# Altium schematic sheet OSSI-1 OBC_3.SchDoc: TITLE:
size 410 x 286 mm; Date: Date:; >LAST_DATE_TIME: 01/11/2015 13:38:47; Sheet:: Sheet:; >SHEET: 4; REV:: REV:; Document Number:: Document Number:; >DRAWING_NAME: OSSI-1 OBC.sch
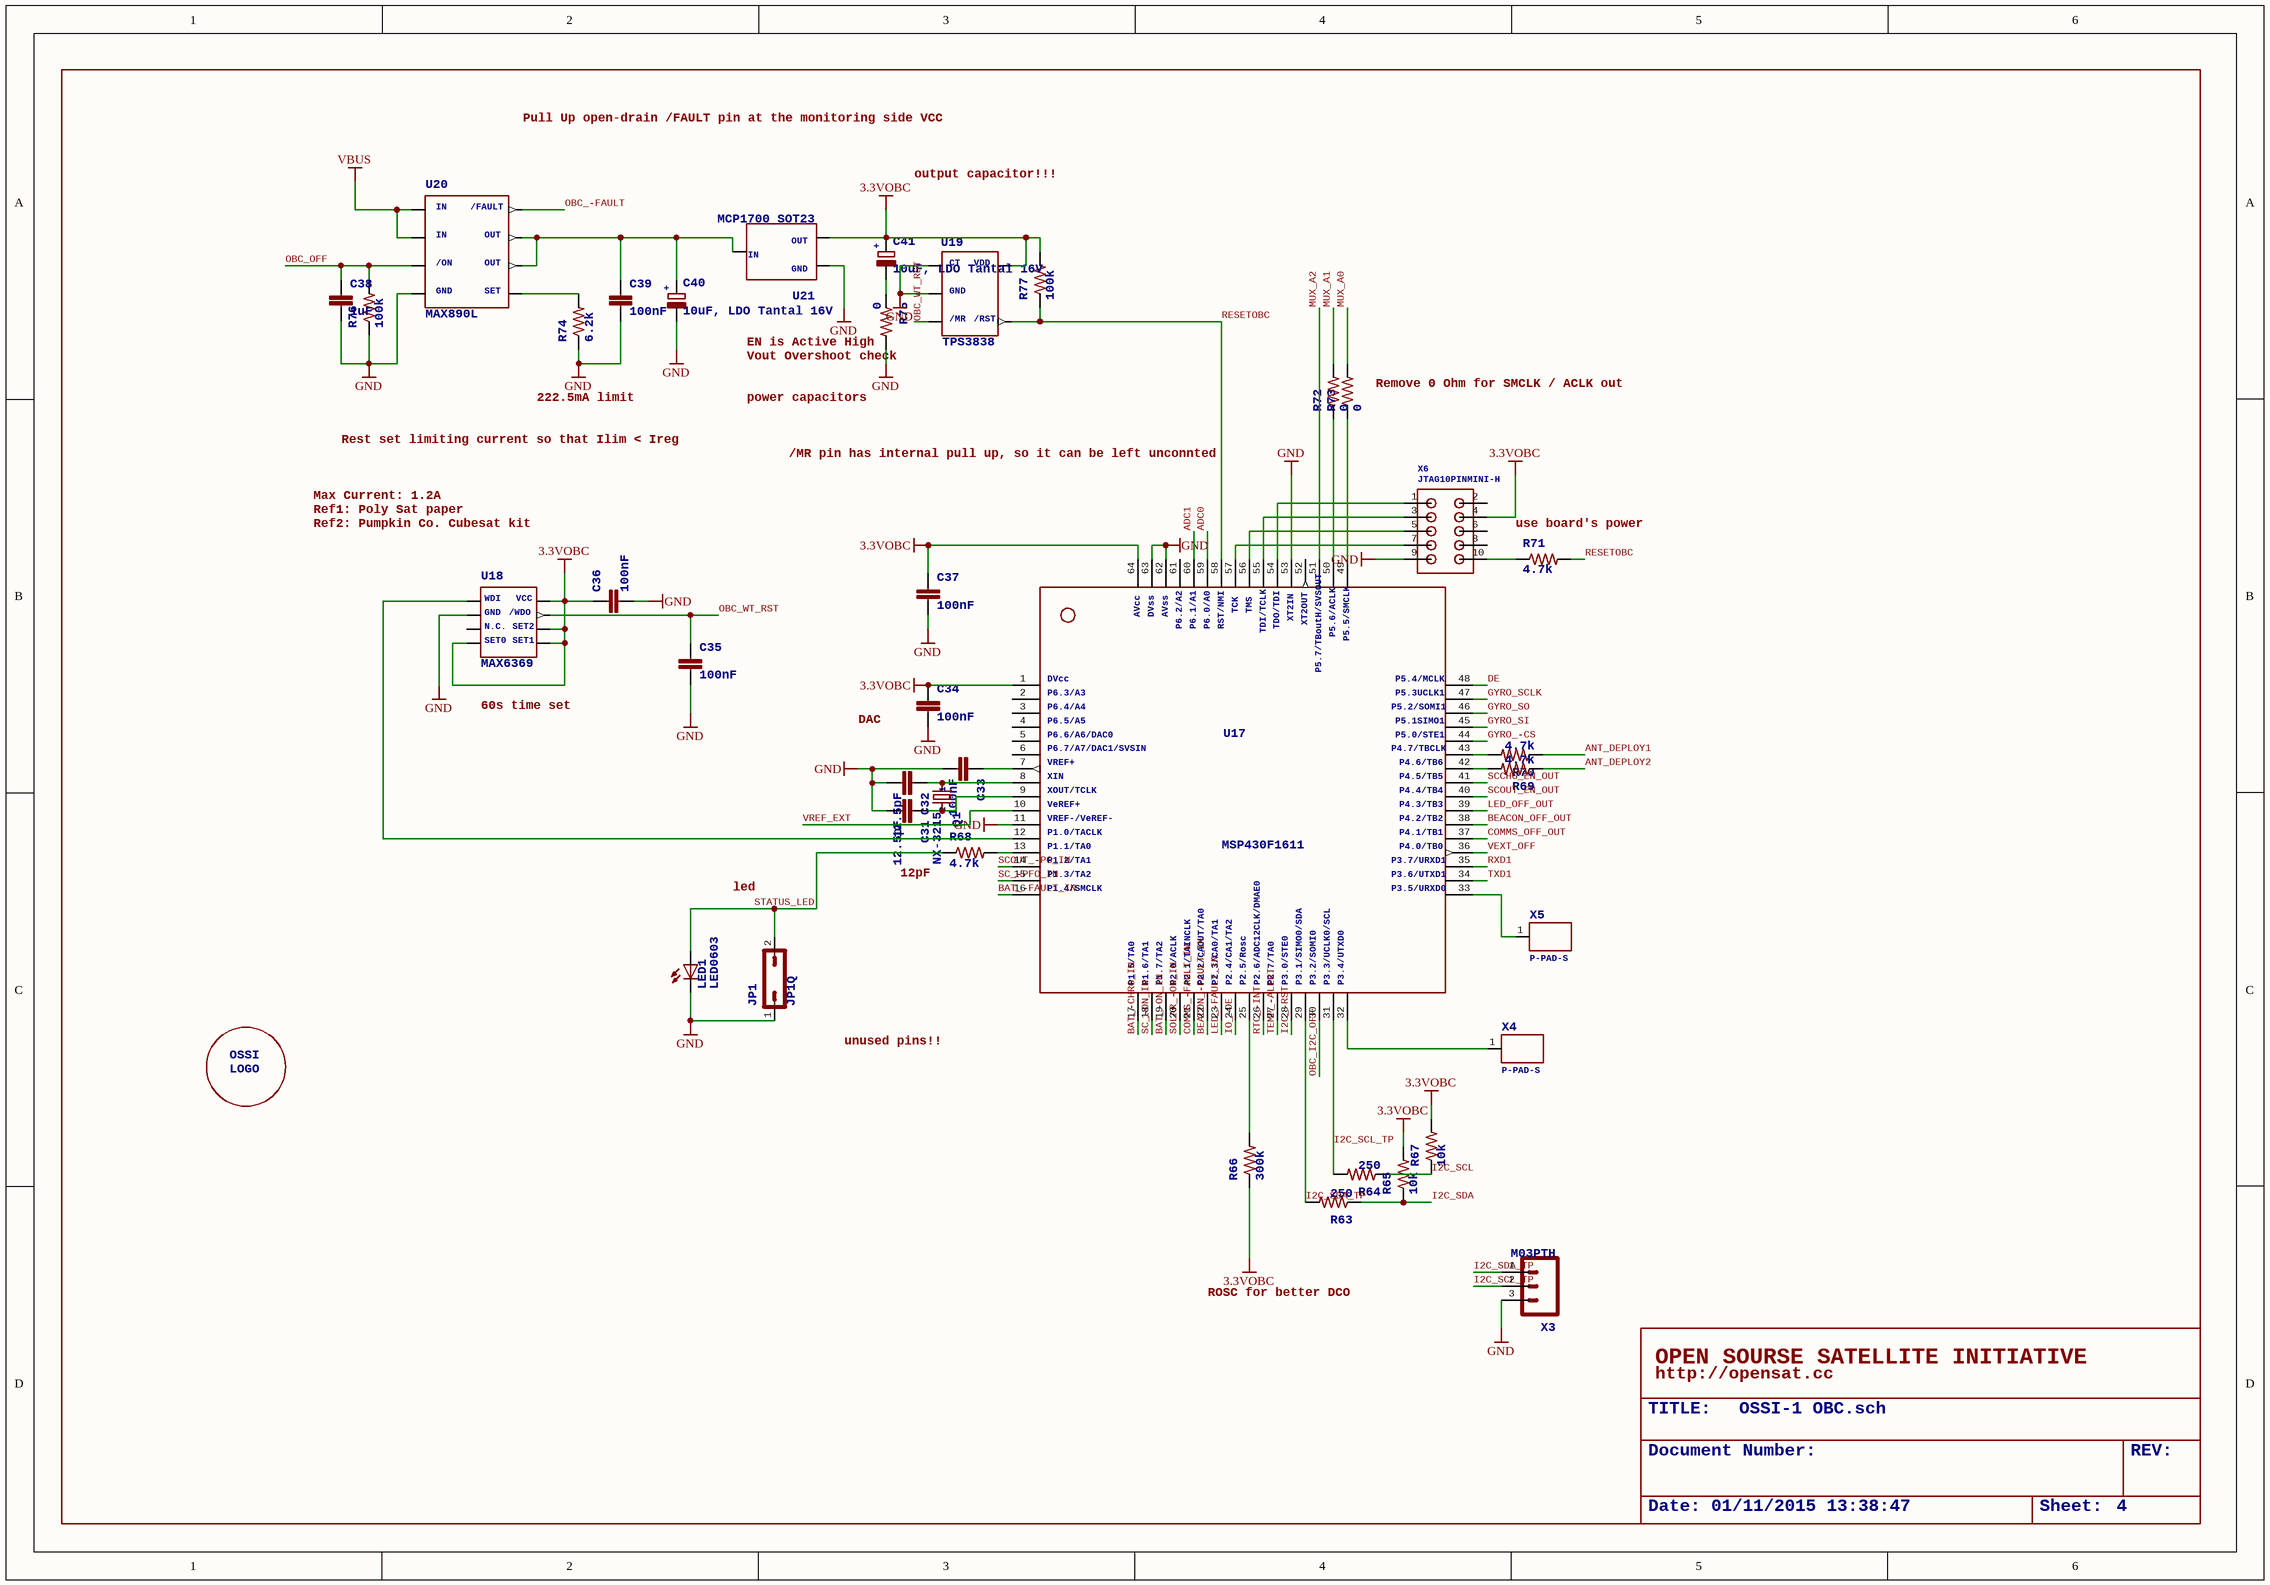
[diagram p0: OSSI-1 OBC_3.SchDoc]

## Parts
C31  >NAME: C31  [C0603(1608)]  (hidden comment: 12.5pF)
C32  >NAME: C32  [C0603(1608)]  (hidden comment: 12.5pF)
C33  >NAME: C33  [C0603(1608)]  (hidden comment: 100nF)
C34  >NAME: C34  [C0603(1608)]  (hidden comment: 100nF)
C35  >NAME: C35  [C0603(1608)]  (hidden comment: 100nF)
C36  >NAME: C36  [C0603(1608)]  (hidden comment: 100nF)
C37  >NAME: C37  [C0603(1608)]  (hidden comment: 100nF)
C38  >NAME: C38  [C0603(1608)]  (hidden comment: 1uF)
C39  >NAME: C39  [C0603(1608)]  (hidden comment: 100nF)
C40  >NAME: C40  [C1206(3216)-A]  (hidden comment: 10uF, LDO Tantal 16V)
C41  >NAME: C41  [C1206(3216)-A]  (hidden comment: 10uF, LDO Tantal 16V)
JP1  JP1Q  [JP1]
LED1  >NAME: LED1  [LED-0603]  (hidden comment: LED0603)
Q1  >NAME: Q1  [NX-3215]  (hidden comment: NX-3215)
R63  >NAME: R63  [R0603(1608)]  (hidden comment: 250)
R64  >NAME: R64  [R0603(1608)]  (hidden comment: 250)
R65  >NAME: R65  [R0603(1608)]  (hidden comment: 10k)
R66  >NAME: R66  [R0603(1608)]  (hidden comment: 300k)
R67  >NAME: R67  [R0603(1608)]  (hidden comment: 10k)
R68  >NAME: R68  [R0603(1608)]  (hidden comment: 4.7k)
R69  >NAME: R69  [R0603(1608)]  (hidden comment: 4.7k)
R70  >NAME: R70  [R0603(1608)]  (hidden comment: 4.7k)
R71  >NAME: R71  [R0603(1608)]  (hidden comment: 4.7k)
R72  >NAME: R72  [R0603(1608)]  (hidden comment: 0)
R73  >NAME: R73  [R0603(1608)]  (hidden comment: 0)
R74  >NAME: R74  [R0603(1608)]  (hidden comment: 6.2k)
R75  >NAME: R75  [R0603(1608)]  (hidden comment: 0)
R76  >NAME: R76  [R0603(1608)]  (hidden comment: 100k)
R77  >NAME: R77  [R0603(1608)]  (hidden comment: 100k)
U17  >NAME: U17  [PM/PAG64]  (hidden comment: MSP430F1611)
U18  >NAME: U18  [SOT23-8]  (hidden comment: MAX6369)
U19  >NAME: U19  [SOT23-5DBV]  (hidden comment: TPS3838)
U20  >NAME: U20  [SO8]  (hidden comment: MAX890L)
U21  >NAME: U21  [SOT23]  (hidden comment: MCP1700_SOT23)
U$1  OSSILOGORECT  [OSSILOGORECT1005]  (value not drawn)
X3  >NAME: X3  [1X03]  (hidden comment: M03PTH)
X4  >NAME: X4  [P-PAD-S]  (hidden comment: P-PAD-S)
X5  >NAME: X5  [P-PAD-S]  (hidden comment: P-PAD-S)
X6  >NAME: X6  [M50-3200545]  (hidden comment: JTAG10PINMINI-H)

## Nets
3.3VOBC: C34.1 C36.1 C37.1 C41.1(+) R65.2 R66.1 R67.2 R77.2 U17.1 U17.64 U18.4(P$4) U18.5(P$5) U18.6(P$6) U18.8(P$8) U19.5(P$5) U21.2 X6.4
GND: C31.2 C32.2 C33.2 C34.2 C35.2 C36.2 C37.2 C38.2 C39.2 C40.2(-) JP1.1 LED1.C R74.1 R75.2 R76.1 U17.11 U17.53 U17.62 U17.63 U18.2(P$2) U19.1(P$1) U19.2(P$2) U20.4(P$4) U21.1 X3.3 X6.9
VBUS: U20.1(P$1) U20.2(P$2)
ADC0: U17.59
ADC1: U17.60
ANT_DEPLOY1: R70.1
ANT_DEPLOY2: R69.1
BAT_-CHRG_IN: U17.17
BAT_-FAULT_IN: U17.16
BAT_-ON_IN: U17.19
BEACON_-FAULT_IN: U17.22
BEACON_OFF_OUT: U17.38
COMMS_-FAULT_IN: U17.21
COMMS_OFF_OUT: U17.37
DE: U17.48
GYRO_-CS: U17.44
GYRO_SCLK: U17.47
GYRO_SI: U17.45
GYRO_SO: U17.46
I2C_-RST: U17.28
I2C_SCL: R64.1 R67.1
I2C_SCL_TP: R64.2 U17.31 X3.2
I2C_SDA: R63.1 R65.1
I2C_SDA_TP: R63.2 U17.29 X3.1
IO_-OE: U17.24
LED_-FAULT_IN: U17.23
LED_OFF_OUT: U17.39
MUX_A0: R73.2
MUX_A1: R72.2
MUX_A2: U17.51
OBC_-FAULT: U20.8(P$8)
OBC_I2C_OFF: U17.30
OBC_OFF: C38.1 R76.2 U20.3(P$3)
OBC_WT_RST: C35.1 U18.7(P$7) U19.3(P$3)
RESETOBC: R71.2 R77.1 U17.58 U19.4(P$4)
RTC_-INT: U17.26
RXD1: U17.35
SC_-ON_IN: U17.18
SC_-PFO_IN: U17.15
SCCHG_EN_OUT: U17.41
SCOUT_-PG_IN: U17.14
SCOUT_EN_OUT: U17.40
SOLAR_-ON_IN: U17.20
STATUS_LED: JP1.2 LED1.A R68.1
TEMP_-ALERT: U17.27
TXD1: U17.34
VEXT_OFF: U17.36
VREF_EXT: U17.10
NetC31_1: C31.1 Q1.2 U17.9
NetC32_1: C32.1 Q1.1 U17.8
NetC33_1: C33.1 U17.7
NetC39_1: C39.1 C40.1(+) U20.6(P$6) U20.7(P$7) U21.3
NetC41_2: C41.2(-) R75.1
NetR66_2: R66.2 U17.25
NetR68_2: R68.2 U17.13
NetR69_2: R69.2 U17.42
NetR70_2: R70.2 U17.43
NetR71_1: R71.1 X6.10
NetR72_1: R72.1 U17.50
NetR73_1: R73.1 U17.49
NetR74_2: R74.2 U20.5(P$5)
NetU17_12: U17.12 U18.1(P$1)
NetU17_32: U17.32 X4.1(P$1)
NetU17_33: U17.33 X5.1(P$1)
NetU17_54: U17.54 X6.1
NetU17_55: U17.55 X6.3
NetU17_56: U17.56 X6.5
NetU17_57: U17.57 X6.7

Not connected (* = marked no-connect by the designer): U17 2 3 4 5 6 52 61; U18 3(P$3); X6 2 6 8

## Notes on the sheet
- Pull Up open-drain /FAULT pin at the monitoring side VCC
- output capacitor!!!
- (near R75) EN is Active High
- 222.5mA limit
- (near R75) Vout Overshoot check
- power capacitors
- Remove 0 Ohm for SMCLK / ACLK out
- Rest set limiting current so that Ilim < Ireg
- /MR pin has internal pull up, so it can be left unconnted
- Max Current: 1.2A
- Ref1: Poly Sat paper
- Ref2: Pumpkin Co. Cubesat kit
- (near R71) use board's power
- 60s time set
- DAC
- led
- (near R68) 12pF
- unused pins!!
- ROSC for better DCO
- OPEN SOURSE SATELLITE INITIATIVE
- http://opensat.cc

## Library data of the parts
C31-C39 = C0603(1608)
  C31 C32: >VALUE: 12.5pF
  C33-C37 C39: >VALUE: 100nF
  C38: >VALUE: 1uF
C40 C41 = C-TANTAL-A: <b>TAJA105M020RNJ</b> / <ul> / <li>Tantal Capacitor / </li> / <li>Manufacturer: AVX / </li> / <li>1206(3126) / </li> / <li>Ref: www.avx.com/docs/techinfo/tantappl.pdf</li> / </ul>; +: +; >VALUE: 10uF, LDO Tantal 16V
JP1 = JP1Q: <b>JUMPER</b>; >NAME: JP1; >VALUE: JP1Q
LED1 = LED0603: <b>LEDs</b> / Standard schematic elements and footprints for 5mm, 3mm, 1206, and 0603 sized LEDs. 5mm - Spark Fun Electronics SKU : COM-00529 (and others); >VALUE: LED0603
Q1 = NX-3215: NDK 32.768 kHz SMD Crystal<br /> / P/N: NX3215SA-32.768K-STD-MUA-9<br /> / <br /> / <b>Nominal frequency (kHz):</b> 32.768 <br/> / <b>Package Size (L×W×H : mm):</b>  3.2×1.5×0.8 <br/> / <b>Operating Temperature Range(*1)  /  Storage Temperature Range   (°C):</b>  -40 to +85  /  -40 to +85<br/> / <b>Level of drive:</b>   0.1µW (Max. 0.5µW) <br/> / <b>Frequency Tolerance (25±3°C):</b>  ±20×10-6 <br/> / <b>Load Capacitance:</b>  9.0pF, 12.5pF <br/> / <b>Equivalent Series Resistance:</b>  70kΩ Max.<br/> / <b>Ordering Code:</b>  NX3215SA-32.768K-STD-MUA-9 (Load Capacitance9.0pF) /NX3215SA-32.768K-STD-MUA-8 (Load Capacitance12.5pF); >VALUE: NX-3215; 1: 1; 2: 2
R63-R77 = R0603(1608)
  R63 R64: >VALUE: 250
  R65 R67: >VALUE: 10k
  R66: >VALUE: 300k
  R68-R71: >VALUE: 4.7k
  R72 R73 R75: >VALUE: 0
  R74: >VALUE: 6.2k
  R76 R77: >VALUE: 100k
U17 = MSP430F1611: <b>MSP430F1611</b>; AVcc: AVcc; DVss: DVss; AVss: AVss; P6.2/A2: P6.2/A2; P6.1/A1: P6.1/A1; P6.0/A0: P6.0/A0; RST/NMI: RST/NMI; TCK: TCK; TMS: TMS; TDI/TCLK: TDI/TCLK; TDO/TDI: TDO/TDI; XT2IN: XT2IN; XT2OUT: XT2OUT; P5.7/TBoutH/SVSOUT: P5.7/TBoutH/SVSOUT; P5.6/ACLK: P5.6/ACLK; P5.5/SMCLK: P5.5/SMCLK; DVcc: DVcc; P6.3/A3: P6.3/A3; P6.4/A4: P6.4/A4; P6.5/A5: P6.5/A5; P6.6/A6/DAC0: P6.6/A6/DAC0; P6.7/A7/DAC1/SVSIN: P6.7/A7/DAC1/SVSIN; VREF+: VREF+; XIN: XIN; XOUT/TCLK: XOUT/TCLK; VeREF+: VeREF+; VREF-/VeREF-: VREF-/VeREF-; P1.0/TACLK: P1.0/TACLK; P1.1/TA0: P1.1/TA0; P1.2/TA1: P1.2/TA1; P1.3/TA2: P1.3/TA2; P1.4/SMCLK: P1.4/SMCLK; P1.5/TA0: P1.5/TA0; P1.6/TA1: P1.6/TA1; P1.7/TA2: P1.7/TA2; P2.0/ACLK: P2.0/ACLK; P2.1/TAINCLK: P2.1/TAINCLK; P2.2/CAOUT/TA0: P2.2/CAOUT/TA0; P2.3/CA0/TA1: P2.3/CA0/TA1; P2.4/CA1/TA2: P2.4/CA1/TA2; P2.5/Rosc: P2.5/Rosc; P2.6/ADC12CLK/DMAE0: P2.6/ADC12CLK/DMAE0; P2.7/TA0: P2.7/TA0; P3.0/STE0: P3.0/STE0; P3.1/SIMO0/SDA: P3.1/SIMO0/SDA; P3.2/SOMI0: P3.2/SOMI0; P3.3/UCLK0/SCL: P3.3/UCLK0/SCL; P3.4/UTXD0: P3.4/UTXD0; P5.4/MCLK: P5.4/MCLK; P5.3UCLK1: P5.3UCLK1; P5.2/SOMI1: P5.2/SOMI1; P5.1SIMO1: P5.1SIMO1; P5.0/STE1: P5.0/STE1; P4.7/TBCLK: P4.7/TBCLK; P4.6/TB6: P4.6/TB6; P4.5/TB5: P4.5/TB5; P4.4/TB4: P4.4/TB4; P4.3/TB3: P4.3/TB3; P4.2/TB2: P4.2/TB2; P4.1/TB1: P4.1/TB1; P4.0/TB0: P4.0/TB0; P3.7/URXD1: P3.7/URXD1; P3.6/UTXD1: P3.6/UTXD1; P3.5/URXD0: P3.5/URXD0; >VALUE: MSP430F1611
U18 = MAX6369: <B>MAX6369</B> / <ul> / <li>Pin-Selectable Watchdog Timers</li> / <li>Max 6369 is Open-drain output</li> / <li>1 ms to 60 s seletable timeout</li> / </ul>; WDI: WDI; GND: GND; N.C.: N.C.; SET0: SET0; SET1: SET1; SET2: SET2; /WDO: /WDO; VCC: VCC; >VALUE: MAX6369
U19 = TPS3838: <b>TPS3838</b> / <br /> / NanoPower Supervisory IC from texas instruments.<br /> / TPS3838 is open-drain output; >VALUE: TPS3838; CT: CT; /MR: /MR; GND: GND; VDD: VDD; /RST: /RST
U20 = MAX890L: <B>MAX 890L</B> / <BR /> / 1.2A, Current-Limited, High-Side / P-Channel Switch with Thermal Shutdown BY MAXIM; IN: IN; /ON: /ON; GND: GND; SET: SET; OUT: OUT; /FAULT: /FAULT; >VALUE: MAX890L
U21 = MCP1700_SOT23: MCP1700 LDO from Microchips; >VALUE: MCP1700_SOT23; IN: IN; GND: GND; OUT: OUT
X3 = M03PTH: <b>Header 3</b> / Standard 3-pin 0.1" header. Use with straight break away headers (SKU : PRT-00116), right angle break away headers (PRT-00553), swiss pins (PRT-00743), machine pins (PRT-00117), and female headers (PRT-00115). Molex polarized connector foot print use with SKU : PRT-08232 with associated crimp pins and housings.; >VALUE: M03PTH
U$1 = OSSILOGORECT: OSSI: OSSI; LOGO: LOGO
X4 X5 = P-PAD-S: >VALUE: P-PAD-S
X6 = JTAG10PINMINI-H: >VALUE: JTAG10PINMINI-H